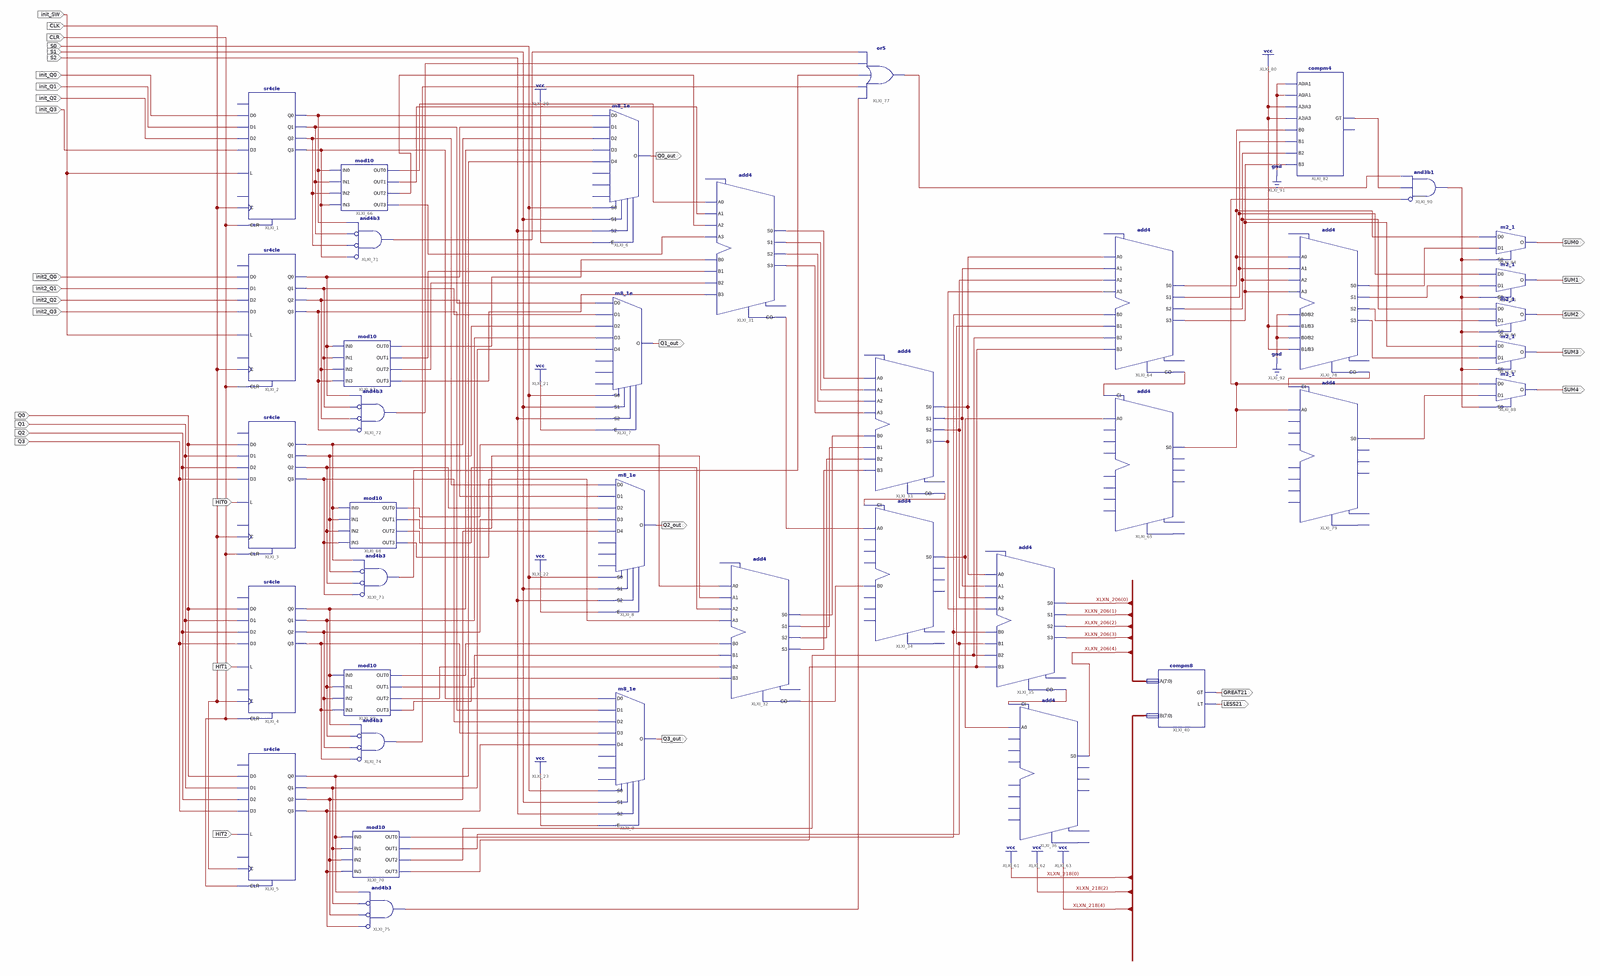
[diagram p0: schematic sheet 1, whole]
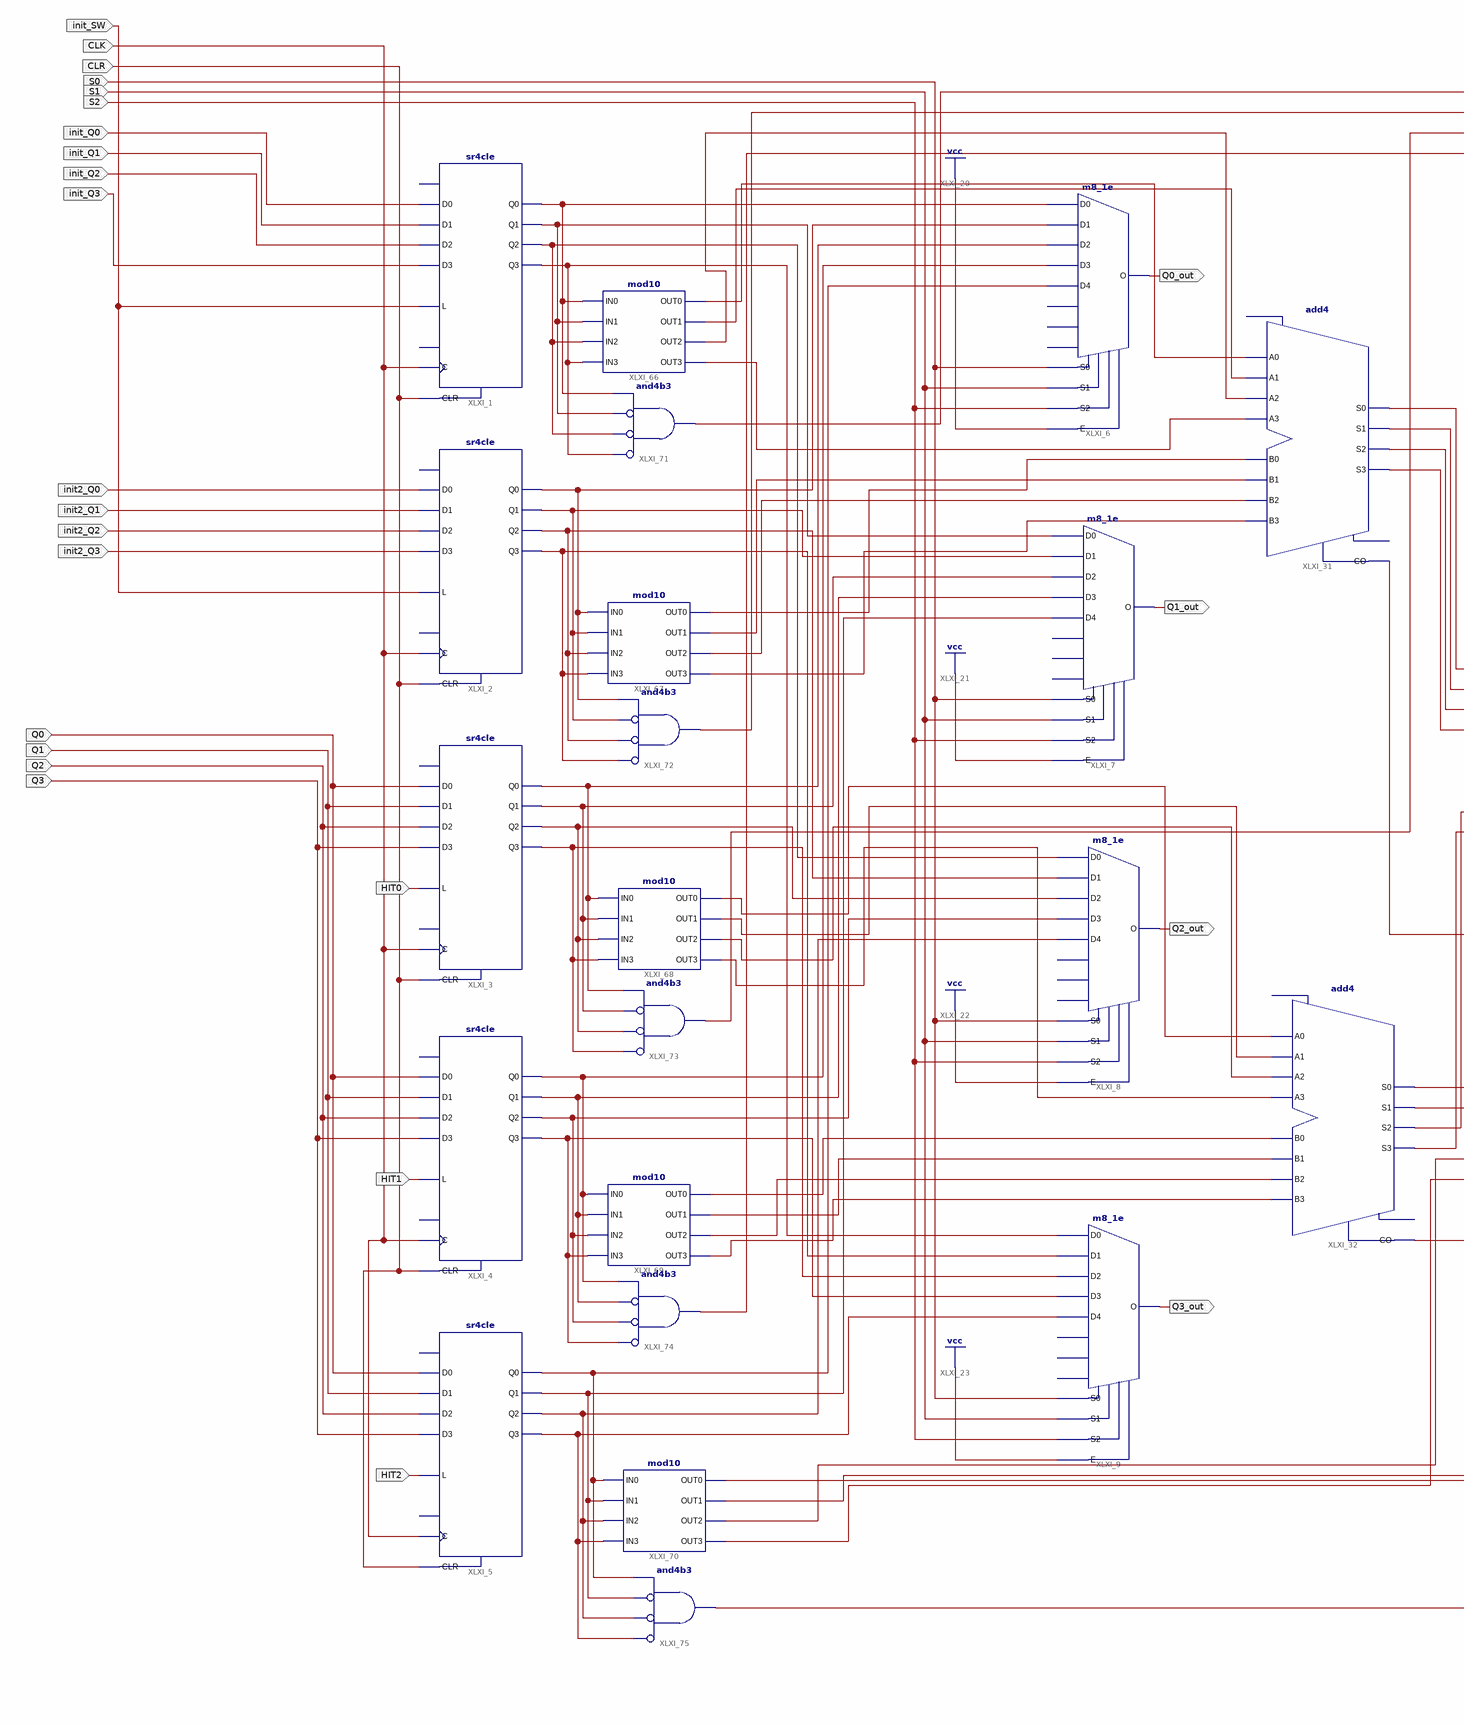
[diagram p1: schematic sheet 1, left part]
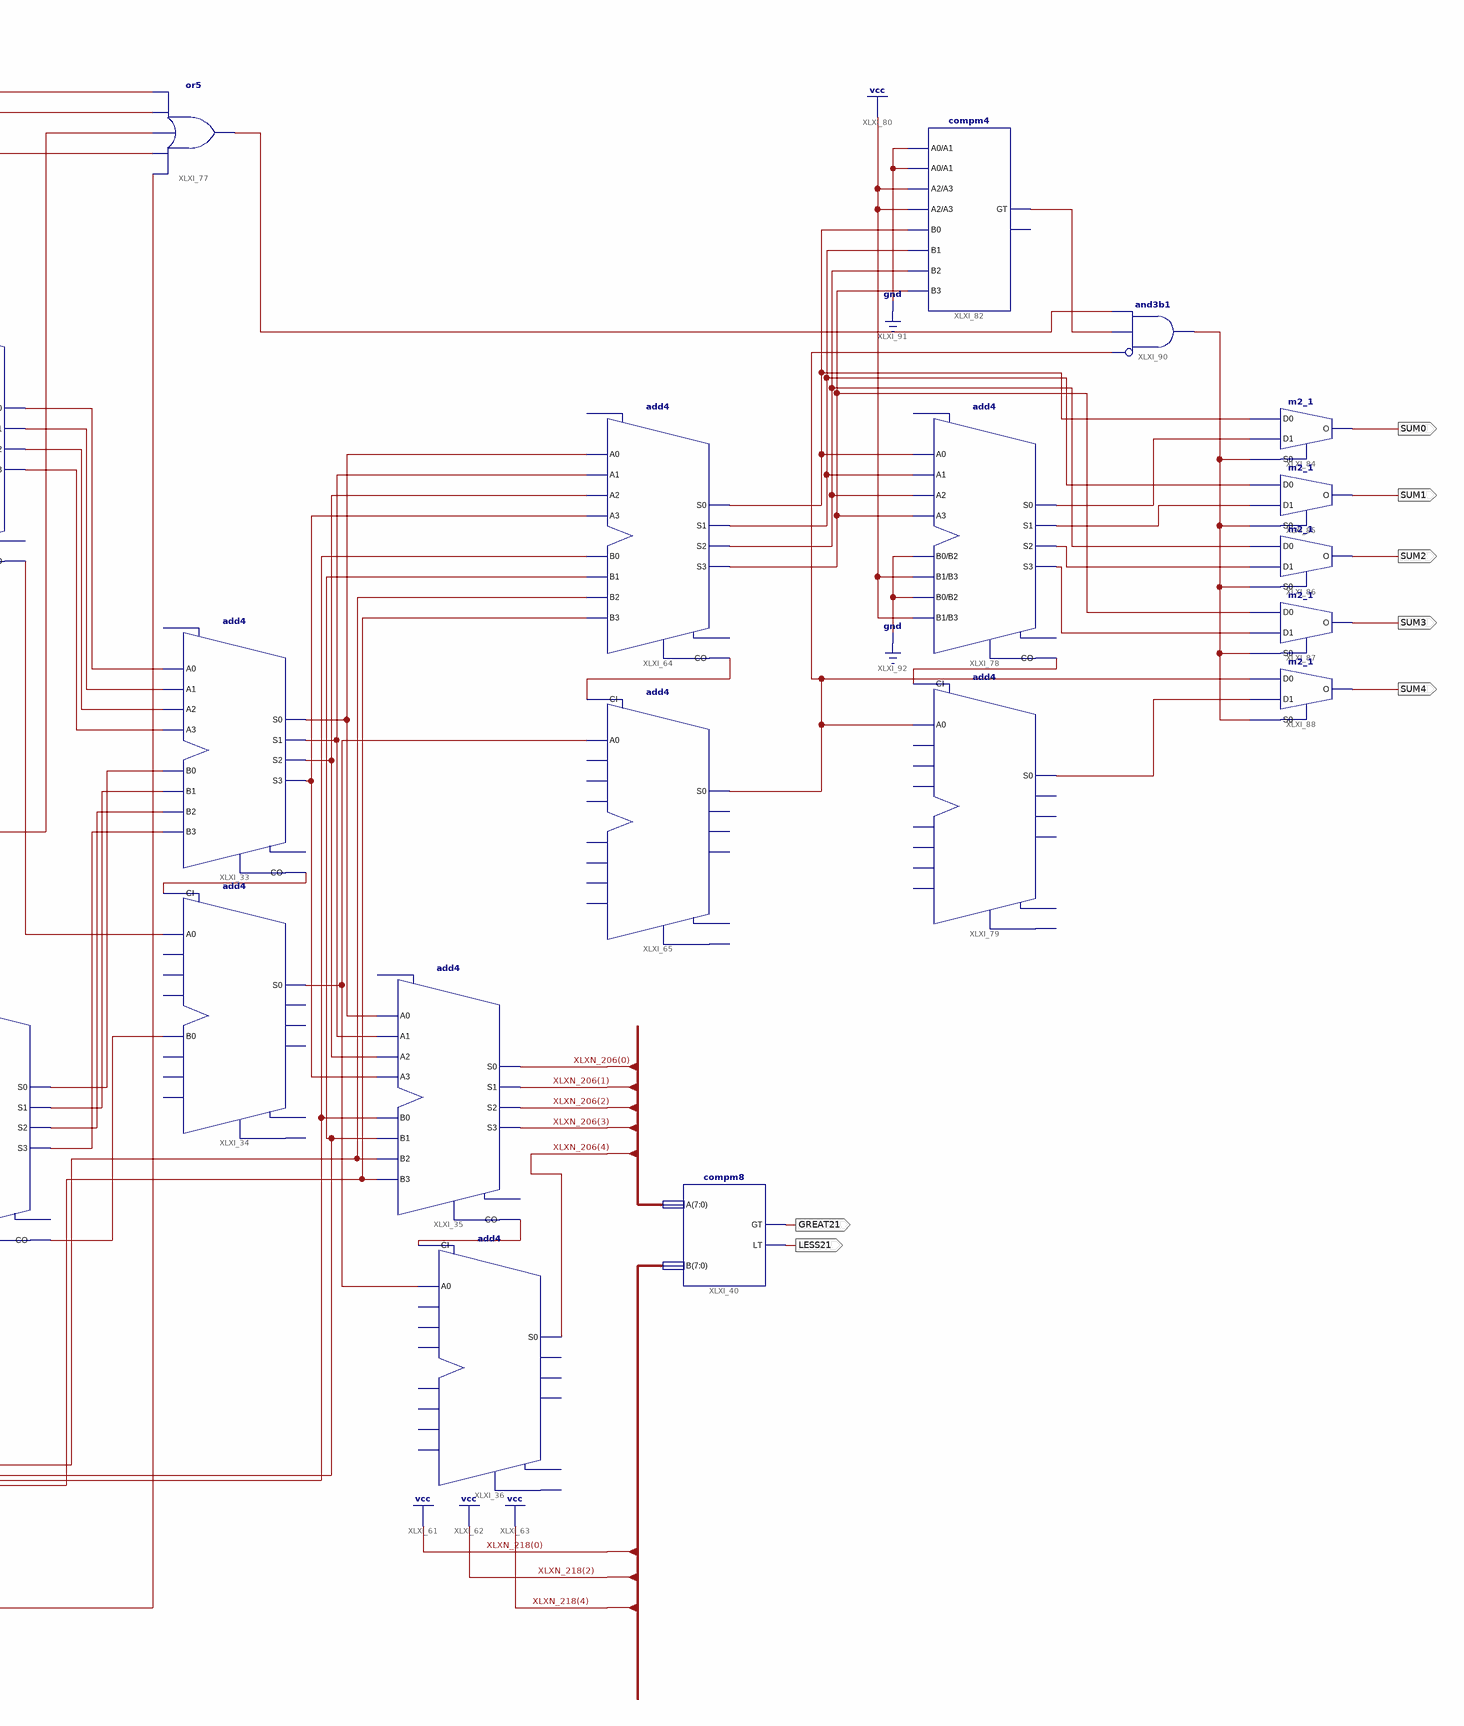
[diagram p2: schematic sheet 1, right part]
// Xilinx ISE schematic playerCard.sch (spartan3) as structural Verilog: 38 symbols, 32 ports
module playerCard (
  input  Q0,
  input  Q1,
  input  Q2,
  input  Q3,
  input  CLK,
  input  CLR,
  input  S2,
  input  S0,
  input  S1,
  input  init_Q3,
  input  init_Q2,
  input  init_Q1,
  input  init_Q0,
  input  init2_Q0,
  input  init2_Q1,
  input  init2_Q2,
  input  init2_Q3,
  input  init_SW,
  input  HIT0,
  input  HIT1,
  input  HIT2,
  output Q1_out,
  output Q2_out,
  output Q3_out,
  output Q0_out,
  output LESS21,
  output GREAT21,
  output SUM4,
  output SUM0,
  output SUM3,
  output SUM2,
  output SUM1
);

  wire XLXN_117, XLXN_118, XLXN_119, XLXN_120, XLXN_121, XLXN_122, XLXN_123, XLXN_124, XLXN_126, XLXN_127,
       XLXN_128, XLXN_129, XLXN_276, XLXN_277, XLXN_278, XLXN_279, XLXN_280, XLXN_281, XLXN_290, XLXN_291,
       XLXN_294, XLXN_295, XLXN_296, XLXN_297, XLXN_298, XLXN_299, XLXN_300, XLXN_301, XLXN_302, XLXN_303,
       XLXN_304, XLXN_305, XLXN_306, XLXN_307, XLXN_308, XLXN_309, XLXN_310, XLXN_311, XLXN_312, XLXN_313,
       XLXN_315, XLXN_316, XLXN_317, XLXN_318, XLXN_319, XLXN_321, XLXN_323, XLXN_325, XLXN_327, XLXN_329,
       XLXN_330, XLXN_331, XLXN_333, XLXN_335, XLXN_336, XLXN_337, XLXN_338, XLXN_339, XLXN_362, XLXN_363,
       XLXN_364, XLXN_365, XLXN_366, XLXN_391, XLXN_407, XLXN_408, XLXN_409, XLXN_410, XLXN_415, XLXN_416,
       XLXN_417, XLXN_419, XLXN_420, XLXN_421, XLXN_422, XLXN_423, XLXN_424;
  wire [7:0] XLXN_206;
  wire [7:1] XLXN_218;

  sr4cle XLXI_1 (
    .C(CLK), .CLR(CLR), .D0(init_Q0), .D1(init_Q1), .D2(init_Q2), .D3(init_Q3), .L(init_SW), .Q0(XLXN_307),
    .Q1(XLXN_308), .Q2(XLXN_311), .Q3(XLXN_290));  // open: CE, SLI
  sr4cle XLXI_2 (
    .C(CLK), .CLR(CLR), .D0(init2_Q0), .D1(init2_Q1), .D2(init2_Q2), .D3(init2_Q3), .L(init_SW),
    .Q0(XLXN_291), .Q1(XLXN_316), .Q2(XLXN_318), .Q3(XLXN_294));  // open: CE, SLI
  m8_1e XLXI_6 (
    .D0(XLXN_307), .D1(XLXN_291), .D2(XLXN_295), .D3(XLXN_299), .D4(XLXN_303), .E(1'b1), .S0(S0), .S1(S1),
    .S2(S2), .O(Q0_out));  // open: D5, D6, D7
  m8_1e XLXI_7 (
    .D0(XLXN_308), .D1(XLXN_316), .D2(XLXN_296), .D3(XLXN_300), .D4(XLXN_304), .E(1'b1), .S0(S0), .S1(S1),
    .S2(S2), .O(Q1_out));  // open: D5, D6, D7
  m8_1e XLXI_8 (
    .D0(XLXN_311), .D1(XLXN_318), .D2(XLXN_297), .D3(XLXN_301), .D4(XLXN_305), .E(1'b1), .S0(S0), .S1(S1),
    .S2(S2), .O(Q2_out));  // open: D5, D6, D7
  m8_1e XLXI_9 (
    .D0(XLXN_290), .D1(XLXN_294), .D2(XLXN_298), .D3(XLXN_302), .D4(XLXN_306), .E(1'b1), .S0(S0), .S1(S1),
    .S2(S2), .O(Q3_out));  // open: D5, D6, D7
  add4 XLXI_31 (
    .A0(XLXN_309), .A1(XLXN_310), .A2(XLXN_312), .A3(XLXN_313), .B0(XLXN_315), .B1(XLXN_317), .B2(XLXN_319),
    .B3(XLXN_321), .CO(XLXN_122), .S0(XLXN_118), .S1(XLXN_119), .S2(XLXN_120), .S3(XLXN_121));  // open: CI, OFL
  add4 XLXI_32 (
    .A0(XLXN_323), .A1(XLXN_325), .A2(XLXN_327), .A3(XLXN_329), .B0(XLXN_330), .B1(XLXN_331), .B2(XLXN_333),
    .B3(XLXN_335), .CO(XLXN_128), .S0(XLXN_123), .S1(XLXN_124), .S2(XLXN_126), .S3(XLXN_127));  // open: CI, OFL
  add4 XLXI_33 (
    .A0(XLXN_118), .A1(XLXN_119), .A2(XLXN_120), .A3(XLXN_121), .B0(XLXN_123), .B1(XLXN_124), .B2(XLXN_126),
    .B3(XLXN_127), .CO(XLXN_117), .S0(XLXN_277), .S1(XLXN_278), .S2(XLXN_279), .S3(XLXN_280));  // open: CI, OFL
  add4 XLXI_34 (
    .A0(XLXN_122), .B0(XLXN_128), .CI(XLXN_117), .S0(XLXN_281));  // open: A1, A2, A3, B1, B2, B3, CO, OFL, S1, S2, S3
  add4 XLXI_35 (
    .A0(XLXN_277), .A1(XLXN_278), .A2(XLXN_279), .A3(XLXN_280), .B0(XLXN_336), .B1(XLXN_337), .B2(XLXN_338),
    .B3(XLXN_339), .CO(XLXN_129), .S0(XLXN_206[0]), .S1(XLXN_206[1]), .S2(XLXN_206[2]), .S3(XLXN_206[3]));  // open: CI, OFL
  add4 XLXI_36 (
    .A0(XLXN_281), .CI(XLXN_129), .S0(XLXN_206[4]));  // open: A1, A2, A3, B0, B1, B2, B3, CO, OFL, S1, S2, S3
  sr4cle XLXI_3 (
    .C(CLK), .CLR(CLR), .D0(Q0), .D1(Q1), .D2(Q2), .D3(Q3), .L(HIT0), .Q0(XLXN_295), .Q1(XLXN_296),
    .Q2(XLXN_297), .Q3(XLXN_298));  // open: CE, SLI
  sr4cle XLXI_4 (
    .C(CLK), .CLR(CLR), .D0(Q0), .D1(Q1), .D2(Q2), .D3(Q3), .L(HIT1), .Q0(XLXN_299), .Q1(XLXN_300),
    .Q2(XLXN_301), .Q3(XLXN_302));  // open: CE, SLI
  sr4cle XLXI_5 (
    .C(CLK), .CLR(CLR), .D0(Q0), .D1(Q1), .D2(Q2), .D3(Q3), .L(HIT2), .Q0(XLXN_303), .Q1(XLXN_304),
    .Q2(XLXN_305), .Q3(XLXN_306));  // open: CE, SLI
  compm8 XLXI_40 (
    .A(XLXN_206), .B({XLXN_218[7:5], 1'b1, XLXN_218[3], 1'b1, XLXN_218[1], 1'b1}), .GT(GREAT21), .LT(LESS21));
  add4 XLXI_64 (
    .A0(XLXN_277), .A1(XLXN_278), .A2(XLXN_279), .A3(XLXN_280), .B0(XLXN_336), .B1(XLXN_337), .B2(XLXN_338),
    .B3(XLXN_339), .CO(XLXN_276), .S0(XLXN_407), .S1(XLXN_408), .S2(XLXN_409), .S3(XLXN_410));  // open: CI, OFL
  add4 XLXI_65 (.A0(XLXN_281), .CI(XLXN_276), .S0(XLXN_419));  // open: A1, A2, A3, B0, B1, B2, B3, CO, OFL, S1, S2, S3
  mod10 XLXI_66 (
    .IN0(XLXN_307), .IN1(XLXN_308), .IN2(XLXN_311), .IN3(XLXN_290), .OUT0(XLXN_309), .OUT1(XLXN_310),
    .OUT2(XLXN_312), .OUT3(XLXN_313));
  mod10 XLXI_67 (
    .IN0(XLXN_291), .IN1(XLXN_316), .IN2(XLXN_318), .IN3(XLXN_294), .OUT0(XLXN_315), .OUT1(XLXN_317),
    .OUT2(XLXN_319), .OUT3(XLXN_321));
  mod10 XLXI_68 (
    .IN0(XLXN_295), .IN1(XLXN_296), .IN2(XLXN_297), .IN3(XLXN_298), .OUT0(XLXN_323), .OUT1(XLXN_325),
    .OUT2(XLXN_327), .OUT3(XLXN_329));
  mod10 XLXI_69 (
    .IN0(XLXN_299), .IN1(XLXN_300), .IN2(XLXN_301), .IN3(XLXN_302), .OUT0(XLXN_330), .OUT1(XLXN_331),
    .OUT2(XLXN_333), .OUT3(XLXN_335));
  mod10 XLXI_70 (
    .IN0(XLXN_303), .IN1(XLXN_304), .IN2(XLXN_305), .IN3(XLXN_306), .OUT0(XLXN_336), .OUT1(XLXN_337),
    .OUT2(XLXN_338), .OUT3(XLXN_339));
  and XLXI_71 (XLXN_362, ~XLXN_290, ~XLXN_311, ~XLXN_308, XLXN_307);  // and4b3
  and XLXI_72 (XLXN_363, ~XLXN_294, ~XLXN_318, ~XLXN_316, XLXN_291);  // and4b3
  and XLXI_73 (XLXN_364, ~XLXN_298, ~XLXN_297, ~XLXN_296, XLXN_295);  // and4b3
  and XLXI_74 (XLXN_365, ~XLXN_302, ~XLXN_301, ~XLXN_300, XLXN_299);  // and4b3
  and XLXI_75 (XLXN_366, ~XLXN_306, ~XLXN_305, ~XLXN_304, XLXN_303);  // and4b3
  or XLXI_77 (XLXN_416, XLXN_366, XLXN_365, XLXN_364, XLXN_363, XLXN_362);
  add4 XLXI_78 (
    .A0(XLXN_407), .A1(XLXN_408), .A2(XLXN_409), .A3(XLXN_410), .B0(1'b0), .B1(1'b1), .B2(1'b0), .B3(1'b1),
    .CO(XLXN_391), .S0(XLXN_420), .S1(XLXN_421), .S2(XLXN_422), .S3(XLXN_423));  // open: CI, OFL
  add4 XLXI_79 (.A0(XLXN_419), .CI(XLXN_391), .S0(XLXN_424));  // open: A1, A2, A3, B0, B1, B2, B3, CO, OFL, S1, S2, S3
  compm4 XLXI_82 (
    .A0(1'b0), .A1(1'b0), .A2(1'b1), .A3(1'b1), .B0(XLXN_407), .B1(XLXN_408), .B2(XLXN_409), .B3(XLXN_410),
    .GT(XLXN_415));  // open: LT
  m2_1 XLXI_84 (.D0(XLXN_407), .D1(XLXN_420), .S0(XLXN_417), .O(SUM0));
  m2_1 XLXI_85 (.D0(XLXN_408), .D1(XLXN_421), .S0(XLXN_417), .O(SUM1));
  m2_1 XLXI_86 (.D0(XLXN_409), .D1(XLXN_422), .S0(XLXN_417), .O(SUM2));
  m2_1 XLXI_87 (.D0(XLXN_410), .D1(XLXN_423), .S0(XLXN_417), .O(SUM3));
  m2_1 XLXI_88 (.D0(XLXN_419), .D1(XLXN_424), .S0(XLXN_417), .O(SUM4));
  and XLXI_90 (XLXN_417, ~XLXN_419, XLXN_415, XLXN_416);  // and3b1
endmodule
